# Altium schematic sheet Moderkort.SchDoc
size 431 x 279 mm; SheetNumber: 1; SheetTotal: 2
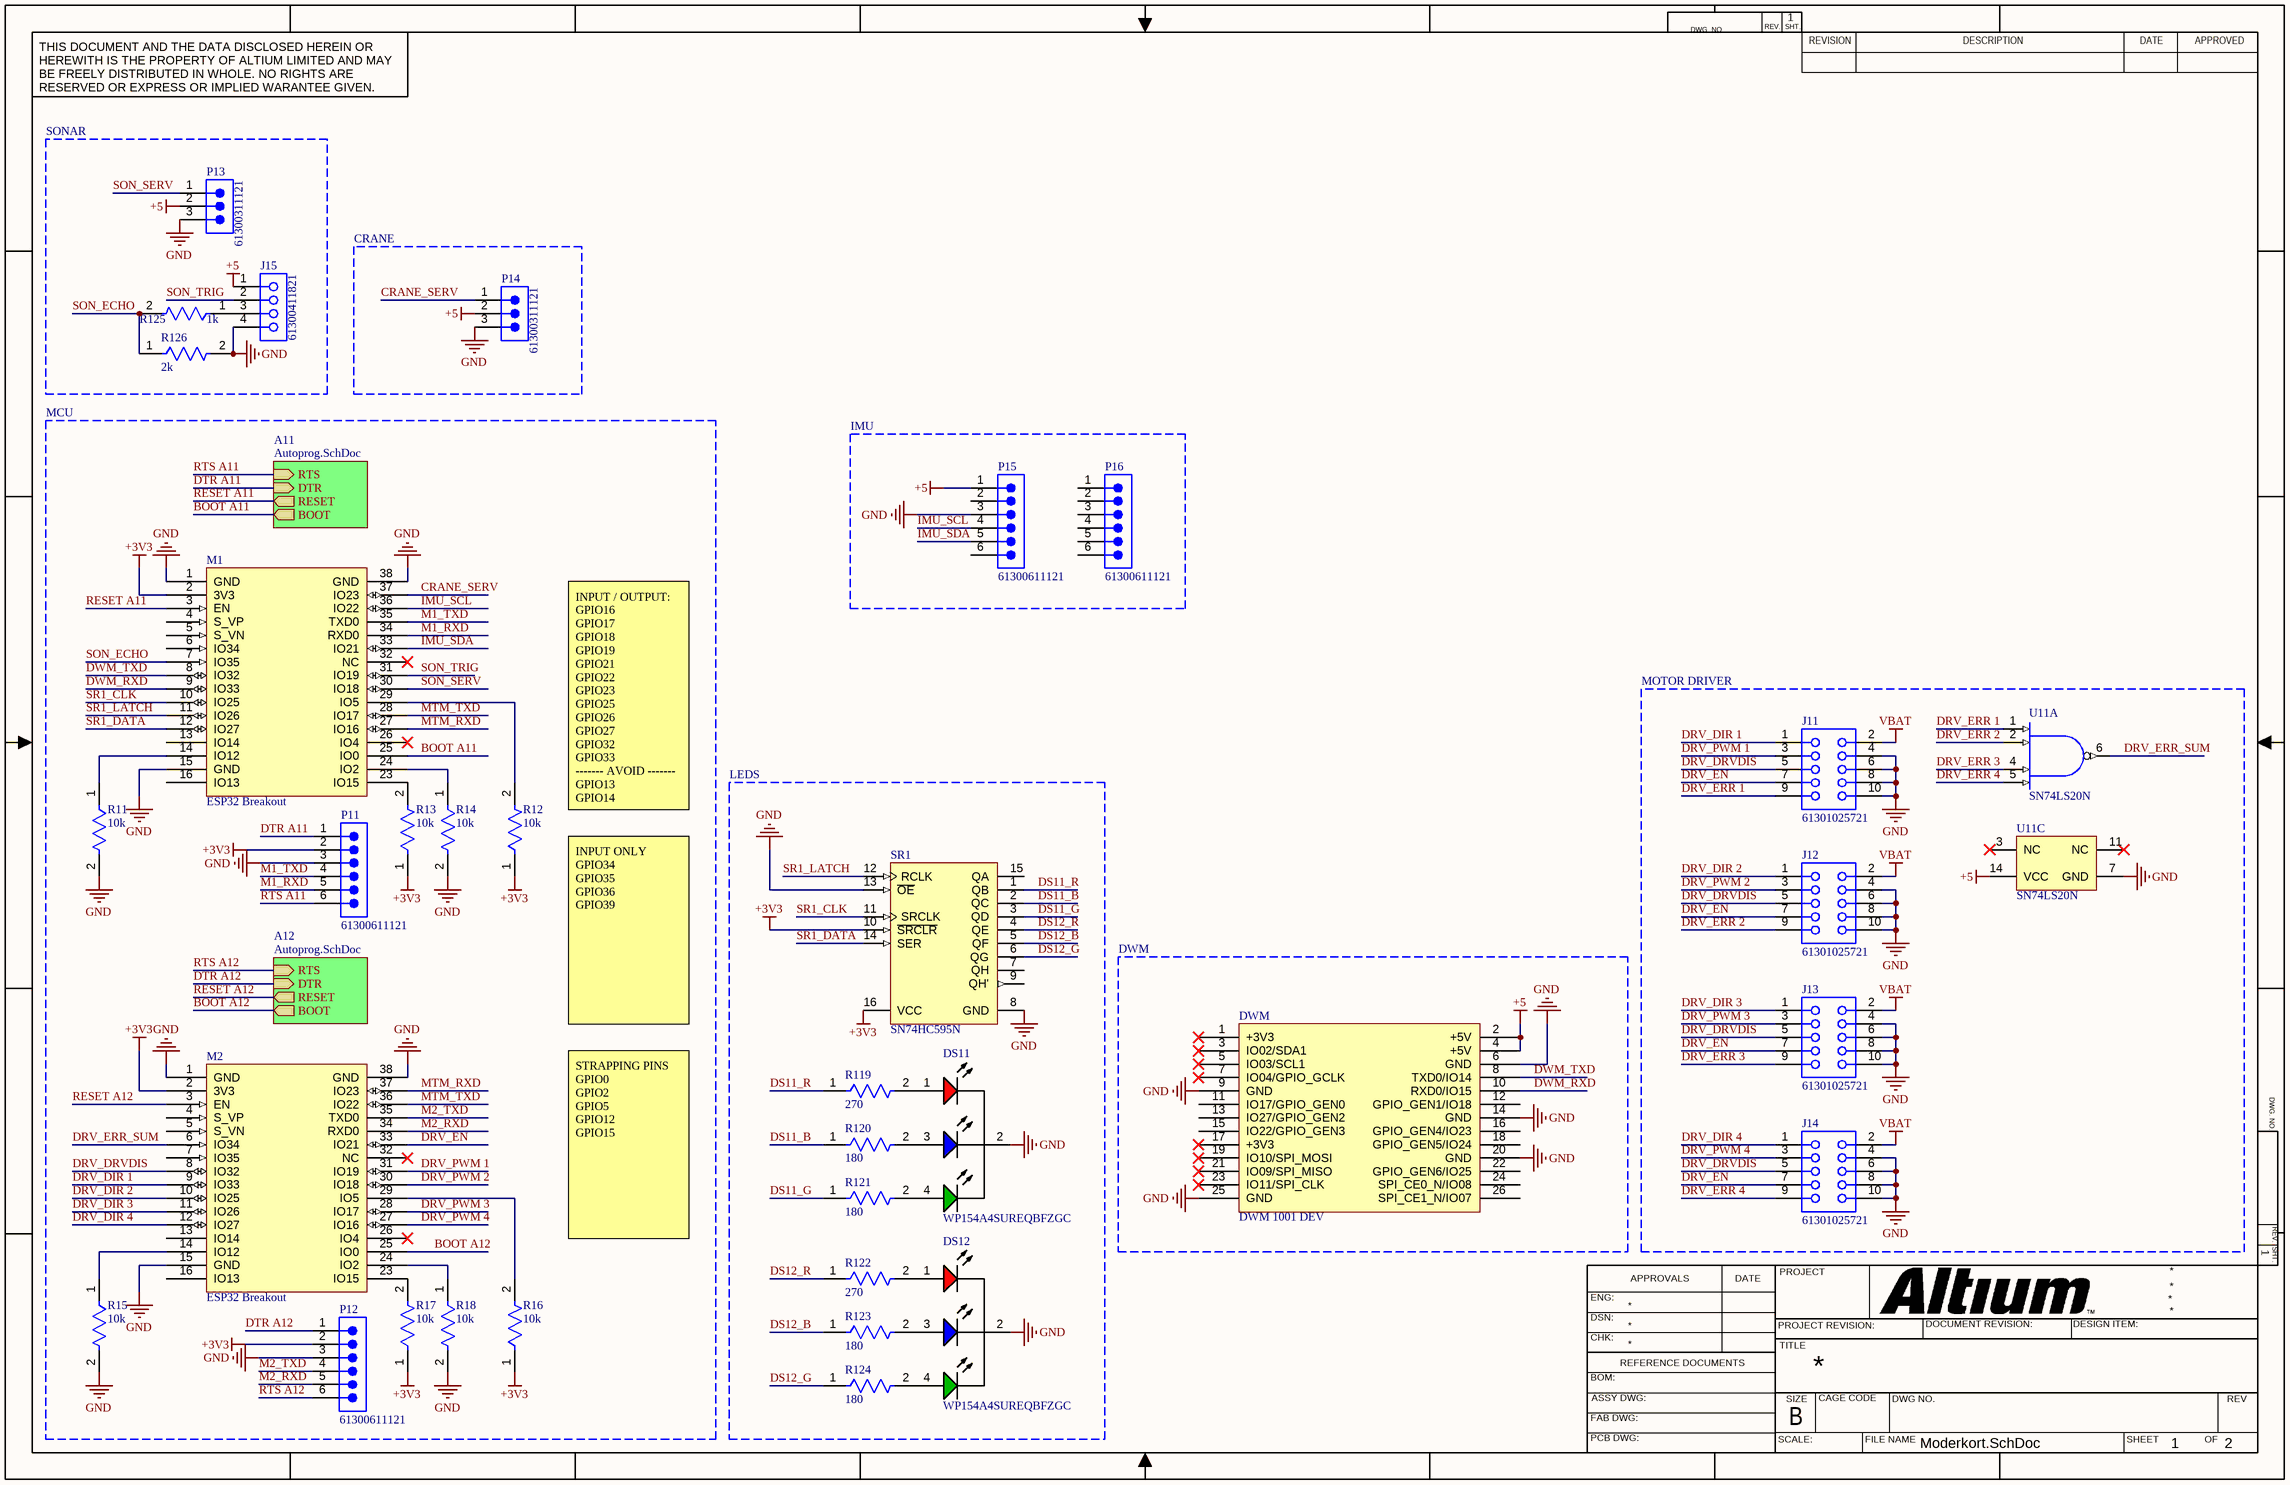
[diagram p0: Moderkort.SchDoc]

## Parts
DS11  WP154A4SUREQBFZGC  [KING-WP154A4SUREQBFZGC_V]
DS12  WP154A4SUREQBFZGC  [KING-WP154A4SUREQBFZGC_V]
DWM  DWM 1001 DEV  [DWM-1001 DEV]
J11  61301025721  [61301025721]
J12  61301025721  [61301025721]
J13  61301025721  [61301025721]
J14  61301025721  [61301025721]
J15  61300411821  [61300411821]
M1  ESP32 Breakout  [ESP32 Breakout]
M2  ESP32 Breakout  [ESP32 Breakout]
P11  61300611121  [61300611121]
P12  61300611121  [61300611121]
P13  61300311121  [61300311121]
P14  61300311121  [61300311121]
P15  61300611121  [61300611121]
P16  61300611121  [61300611121]
R11  value 10k  [FP-RT1206-IPC_C]  (hidden comment: RT1206BRD07470RL)
R12  value 10k  [FP-RT1206-IPC_C]  (hidden comment: RT1206BRD07470RL)
R13  value 10k  [FP-RT1206-IPC_C]  (hidden comment: RT1206BRD07470RL)
R14  value 10k  [FP-RT1206-IPC_C]  (hidden comment: RT1206BRD07470RL)
R15  value 10k  [FP-RT1206-IPC_C]  (hidden comment: RT1206BRD07470RL)
R16  value 10k  [FP-RT1206-IPC_C]  (hidden comment: RT1206BRD07470RL)
R17  value 10k  [FP-RT1206-IPC_C]  (hidden comment: RT1206BRD07470RL)
R18  value 10k  [FP-RT1206-IPC_C]  (hidden comment: RT1206BRD07470RL)
R119  value 270  [FP-RT1206-IPC_C]  (hidden comment: RT1206BRD07470RL)
R120  value 180  [FP-RT1206-IPC_C]  (hidden comment: RT1206BRD07470RL)
R121  value 180  [FP-RT1206-IPC_C]  (hidden comment: RT1206BRD07470RL)
R122  value 270  [FP-RT1206-IPC_C]  (hidden comment: RT1206BRD07470RL)
R123  value 180  [FP-RT1206-IPC_C]  (hidden comment: RT1206BRD07470RL)
R124  value 180  [FP-RT1206-IPC_C]  (hidden comment: RT1206BRD07470RL)
R125  value 1k  [FP-RT1206-IPC_C]  (hidden comment: RT1206BRD07470RL)
R126  value 2k  [FP-RT1206-IPC_C]  (hidden comment: RT1206BRD07470RL)
SR1  SN74HC595N  [N0016A]
U11  SN74LS20N  [N0014A]  (parts A,C of 3)

## Blocks framed on the sheet
SONAR: J15 P13 R125 R126
CRANE: P14
MCU: M1 M2 P11 P12 R11-R18
IMU: P15 P16
MOTOR DRIVER: J11-J14 U11
LEDS: DS11 DS12 R119-R124 SR1
DWM: DWM

## Sub-sheets
A11 = Autoprog.SchDoc: RTS (in), DTR (in), RESET (out), BOOT (out)
A12 = Autoprog.SchDoc: RTS (in), DTR (in), RESET (out), BOOT (out)

## Nets
+3V3: M1.2(3V3) M2.2(3V3) P11.2 P12.2 R12.1 R13.1 R16.1 R17.1 SR1.10(~{SRCLR}) SR1.16(VCC)
+5: DWM.2(+5V) DWM.4(+5V) J15.1 P13.2 P14.2 P15.1 U11.14(VCC)
GND: DS11.2(CATHODE) DS12.2(CATHODE) DWM.6(GND) DWM.9(GND) DWM.14(GND) DWM.20(GND) DWM.25(GND) J11.4 J11.6 J11.8 J11.10 J12.4 J12.6 J12.8 J12.10 J13.4 J13.6 J13.8 J13.10 J14.4 J14.6 J14.8 J14.10 J15.4 M1.1(GND) M1.15(GND) M1.38(GND) M2.1(GND) M2.15(GND) M2.38(GND) P11.3 P12.3 P13.3 P14.3 P15.3 R11.2 R14.2 R15.2 R18.2 R126.2 SR1.8(GND) SR1.13(~{OE}) U11.7(GND)
VBAT: J11.2 J12.2 J13.2 J14.2
BOOT A11: M1.25(IO0) ; sheet A11/BOOT
BOOT A12: M2.25(IO0) ; sheet A12/BOOT
CRANE_SERV: M1.37(IO23) P14.1
DRV_DIR 1: J11.1 M2.9(IO33)
DRV_DIR 2: J12.1 M2.10(IO25)
DRV_DIR 3: J13.1 M2.11(IO26)
DRV_DIR 4: J14.1 M2.12(IO27)
DRV_DRVDIS: J11.5 J12.5 J13.5 J14.5 M2.8(IO32)
DRV_EN: J11.7 J12.7 J13.7 J14.7 M2.33(IO21)
DRV_ERR 1: J11.9 U11.1(1A)
DRV_ERR 2: J12.9 U11.2(1B)
DRV_ERR 3: J13.9 U11.4(1C)
DRV_ERR 4: J14.9 U11.5(1D)
DRV_ERR_SUM: M2.6(IO34) U11.6(1Y)
DRV_PWM 1: J11.3 M2.31(IO19)
DRV_PWM 2: J12.3 M2.30(IO18)
DRV_PWM 3: J13.3 M2.28(IO17)
DRV_PWM 4: J14.3 M2.27(IO16)
DS11_B: R120.1 SR1.2(QC)
DS11_G: R121.1 SR1.3(QD)
DS11_R: R119.1 SR1.1(QB)
DS12_B: R123.1 SR1.5(QF)
DS12_G: R124.1 SR1.6(QG)
DS12_R: R122.1 SR1.4(QE)
DTR A11: P11.1 ; sheet A11/DTR
DTR A12: P12.1 ; sheet A12/DTR
DWM_RXD: DWM.10(RXD0/IO15) M1.9(IO33)
DWM_TXD: DWM.8(TXD0/IO14) M1.8(IO32)
IMU_SCL: M1.36(IO22) P15.4
IMU_SDA: M1.33(IO21) P15.5
M1_RXD: M1.34(RXD0) P11.5
M1_TXD: M1.35(TXD0) P11.4
M2_RXD: M2.34(RXD0) P12.5
M2_TXD: M2.35(TXD0) P12.4
MTM_RXD: M1.27(IO16) M2.37(IO23)
MTM_TXD: M1.28(IO17) M2.36(IO22)
RESET A11: M1.3(EN) ; sheet A11/RESET
RESET A12: M2.3(EN) ; sheet A12/RESET
RTS A11: P11.6 ; sheet A11/RTS
RTS A12: P12.6 ; sheet A12/RTS
SON_ECHO: M1.7(IO35) R125.2 R126.1
SON_SERV: M1.30(IO18) P13.1
SON_TRIG: J15.2 M1.31(IO19)
SR1_CLK: M1.10(IO25) SR1.11(SRCLK)
SR1_DATA: M1.12(IO27) SR1.14(SER)
SR1_LATCH: M1.11(IO26) SR1.12(RCLK)
NetDS11_1: DS11.1(RED) R119.2
NetDS11_3: DS11.3(BLUE) R120.2
NetDS11_4: DS11.4(GREEN) R121.2
NetDS12_1: DS12.1(RED) R122.2
NetDS12_3: DS12.3(BLUE) R123.2
NetDS12_4: DS12.4(GREEN) R124.2
NetJ15_3: J15.3 R125.1
NetM1_14: M1.14(IO12) R11.1
NetM1_23: M1.23(IO15) R13.2
NetM1_24: M1.24(IO2) R14.1
NetM1_29: M1.29(IO5) R12.2
NetM2_14: M2.14(IO12) R15.1
NetM2_23: M2.23(IO15) R17.2
NetM2_24: M2.24(IO2) R18.1
NetM2_29: M2.29(IO5) R16.2

Not connected (* = marked no-connect by the designer): DWM 1(+3V3)* 3(IO02/SDA1)* 5(IO03/SCL1)* 7(IO04/GPIO_GCLK)* 11(IO17/GPIO_GEN0) 12(GPIO_GEN1/IO18) 13(IO27/GPIO_GEN2) 15(IO22/GPIO_GEN3) 16(GPIO_GEN4/IO23) 17(+3V3)* 18(GPIO_GEN5/IO24) 19(IO10/SPI_MOSI)* 21(IO09/SPI_MISO)* 22(GPIO_GEN6/IO25) 23(IO11/SPI_CLK)* 24(SPI_CE0_N/IO08) 26(SPI_CE1_N/IO07); M1 4(S_VP) 5(S_VN) 6(IO34) 13(IO14) 16(IO13) 26(IO4)* 32(NC)*; M2 4(S_VP) 5(S_VN) 7(IO35) 13(IO14) 16(IO13) 26(IO4)* 32(NC)*; P15 2 6; P16 1 2 3 4 5 6; SR1 7(QH) 9(QH') 15(QA); U11 3(NC)* 11(NC)*

## Notes on the sheet
- INPUT / OUTPUT:
  GPIO16
  GPIO17
  GPIO18
  GPIO19
  GPIO21
  GPIO22
  GPIO23
  GPIO25
  GPIO26
  GPIO27
  GPIO32
  GPIO33
  ------- AVOID -------
  GPIO13
  GPIO14
- INPUT ONLY
  GPIO34
  GPIO35
  GPIO36
  GPIO39
- STRAPPING PINS
  GPIO0
  GPIO2
  GPIO5
  GPIO12
  GPIO15
- DWG. NO.
- REV.
- SHT.
- THIS DOCUMENT AND THE DATA DISCLOSED HEREIN OR HEREWITH IS THE PROPERTY OF ALTIUM LIMITED AND MAY BE FREELY DISTRIBUTED IN WHOLE. NO RIGHTS ARE RESERVED OR EXPRESS OR IMPLIED WARANTEE GIVEN.
- REVISION
- DESCRIPTION
- DATE
- APPROVED
- ENG:
- APPROVALS
- PROJECT
- DSN:
- CHK:
- REFERENCE DOCUMENTS
- PROJECT REVISION:
- TITLE
- DOCUMENT REVISION:
- DESIGN ITEM:
- BOM:
- FAB DWG:
- PCB DWG:
- ASSY DWG:
- SCALE:
- SIZE
- B
- CAGE CODE
- FILE NAME
- DWG NO.
- SHEET
- OF
- REV

## Library data of the parts
DS11 DS12 = CMP-2000-07415-1: Full Color LED Lamp, Dominant Wavelength RGB 630 / 525 / 465 nm, -40 to 85 degC, 4-Pin THD, RoHS; Manufacturer: Kingbright; Viewing Angle: 50°; Wavelength - Dominant: 630nm,525nm,465nm; Online Catalog: 5mm,T-13/4(RGB)RoundwithDomedTopLEDLamp; Millicandela Rating: 1300mcdRed,1700mcdGreen,900mcdBlue; Other Names: 754-1615 / WP154A4SUREQBFZGC-ND; Current - Test: 20mA; Wavelength - Peak: 645nm,515nm,460nm; Color: Red,Green,Blue(RGB); Voltage - Forward (Vf) (Typ): 1.9VRed,3.3VGreen,3.3VBlue; Lens Type: Clear; 3D Model: WP154A4SUREQBFZGW.sldprt / WP154A4SUREQBFZGW.pro / WP154A4SUREQBFZGW.igs / WP154A4SUREQBFZGW.stp; Lens Style/Size: RoundwithDomedTop,5mm,T-13/4; Packaging: Bulk; Datasheet URL: https://www.kingbrightusa.com/images/catalog/spec/WP154A4SUREQBFZGC.pdf; Family: LEDIndication-Discrete; Datasheet Version: Rev. 5A, 08/2014; Category: Optoelectronics; Manufacturer URL: http://www.kingbright.com/; Height: 8.60mm; Mounting Type: ThroughHole; Package Reference: WP154A4SUREQBFZGC; Mounting Technology: ThroughHole; Package Description: 4-Pin Through Hole LED, Dia 5.9 mm, Pitch 1.27 mm; Standard Package: 500; Package / Case: Radial-4Leads
J11-J14 = CMP-1502-01335-4: THT Vertical Socket Header WR-PHD, Pitch 2.54 mm, Dual Row, 10 pins; Gender: Female; Operating Supply Voltage: 250V; Contact Resistance: 20mΩ; Current Rating: 3A; Lead Pitch: 2.54mm; Orientation: Vertical; Number of Pins: 10
J15 = CMP-1502-01316-4: THT Vertical Socket Header WR-PHD, Pitch 2.54 mm, Single Row, 4 pins; Current Rating: 3A; Gender: Female; Contact Resistance: 20mΩ; Operating Supply Voltage: 250V; Number of Pins: 4; Lead Pitch: 2.54mm; Orientation: Vertical
P11 P12 P15 P16 = CMP-1502-01070-4: THT Vertical Pin Header WR-PHD, Pitch 2.54 mm, Single Row, 6 pins; Pitch: 2.54mm; Operating Supply Voltage: 250V; Connector Type: Male Pin; Gender: Male; Number of Positions: 6; Contact Resistance: 20mΩ; Current Rating: 3A; Termination: Through Hole; Color: Black; Number of Pins: 6; Lead Pitch: 2.54mm; Height: 8.89mm; RoHS: Compliant; Lead Free: Lead Free; Contact Mating Length: 5.9944mm; Contact Plating: Gold; Contact Gender: Male; Packaging: Bulk; Orientation: Vertical; Mount: Through Hole; Voltage Rating: 250V; Number of Rows: 1; Max Operating Temperature: 105°C; Min Operating Temperature: -40°C; Housing Material: PBT; Contact Material: Gold; Number of Contacts: 6
P13 P14 = CMP-1502-01062-4: THT Vertical Pin Header WR-PHD, Pitch 2.54 mm, Single Row, 3 pins; Connector Type: Male Pin; Number of Contacts: 3; Operating Supply Voltage: 250V; Current Rating: 3A; Pitch: 2.54mm; Contact Resistance: 20mΩ; Gender: Male; Height: 8.94mm; Color: Black; Min Operating Temperature: -40°C; Max Operating Temperature: 105°C; Mount: Through Hole; Termination: Solder; Number of Rows: 1; Packaging: Bulk; Number of Pins: 3; Lead Pitch: 2.54mm; RoHS: Compliant; Contact Plating: Gold; Number of Positions: 3; Lead Free: Lead Free; Voltage Rating: 250V; Contact Mating Length: 5.9944mm; Orientation: Vertical; Contact Material: Gold
R11-R18 R119-R126 = CMP-009-00218-1: Fixed Resistor, Thin Film, 0.25W, 470ohm, 200V, 0.1% +/-Tol, 25ppm/Cel, Surface Mount, 1206; Power: 250mW; Additional Feature: HIGH PRECISION; Rated Temperature: 70°C; Package Width: 1.6mm; Temperature Coefficient (ppm/Cel): 25; Package Length: 3.1mm; Package Height: 0.55mm; Construction: Chip; Termination: Wraparound; Pins: 2; Case/Package: 1206; Resistor Type: FIXED RESISTOR; Reach SVHC Compliant: Yes; Tolerance: 0.1%; Technology: THIN FILM; Mounting Technology: Surface Mount; Packaging: Tape and Reel; RoHS Compliant: Yes; Working Voltage: 200V; Min Operating Temperature: -55°C; Max Operating Temperature: 155°C
SR1 = CMP-0780-00137-3: 8-Bit Shift Registers With 3-State Output Registers, N0016A, TUBE; Manufacturer: Texas Instruments; F @ Nom Voltage(Max)(Mhz): 28; Input Type: CMOS; Bits: 8; VCC(Min)(V): 2; 3-State Output: Yes; ICC @ Nom Voltage(Max)(mA): 0.08; VCC(Max)(V): 6; tpd @ Nom Voltage(Max)(ns): 34; Rating: Military; Technology Family: HC; Output Drive (IOL/IOH)(Max)(mA): 7.8/-7.8; Code_JEDEC: MS-001; Output Type: CMOS; Operating Temperature Range(C): -40 to 85; Voltage(Nom)(V): 6; Generic Part Number: SN74HC595; DatasheetVersion: SCLS041H; PackageReference: N0016A; PackageVersion: http://www.ti.com/lit/ml/mpdi002c/mpdi002c.pdf
U11 = CMP-1627-00458-2: Dual 4-input positive-NAND gates, N0014A, TUBE; Manufacturer: Texas Instruments; Technology Family: LS; ICC @ Nom Voltage(Max)(mA): 0.011; Output Type: TTL; Rating: Catalog; F @ Nom Voltage(Max)(Mhz): 35; VCC(Min)(V): 4.75; Schmitt Trigger: No; Bits(#): 2; tpd @ Nom Voltage(Max)(ns): 22; Output Drive (IOL/IOH)(Max)(mA): 0.4/-16; Voltage(Nom)(V): 5; VCC(Max)(V): 5.25; Operating Temperature Range(C): 0 to 70; DatasheetVersion: SDLS079; Code_JEDEC: MS-001; Generic Part Number: SN74LS20; Input Type: TTL; PackageReference: N0014A